# EAGLE design INS (EAGLE 9.6.2)
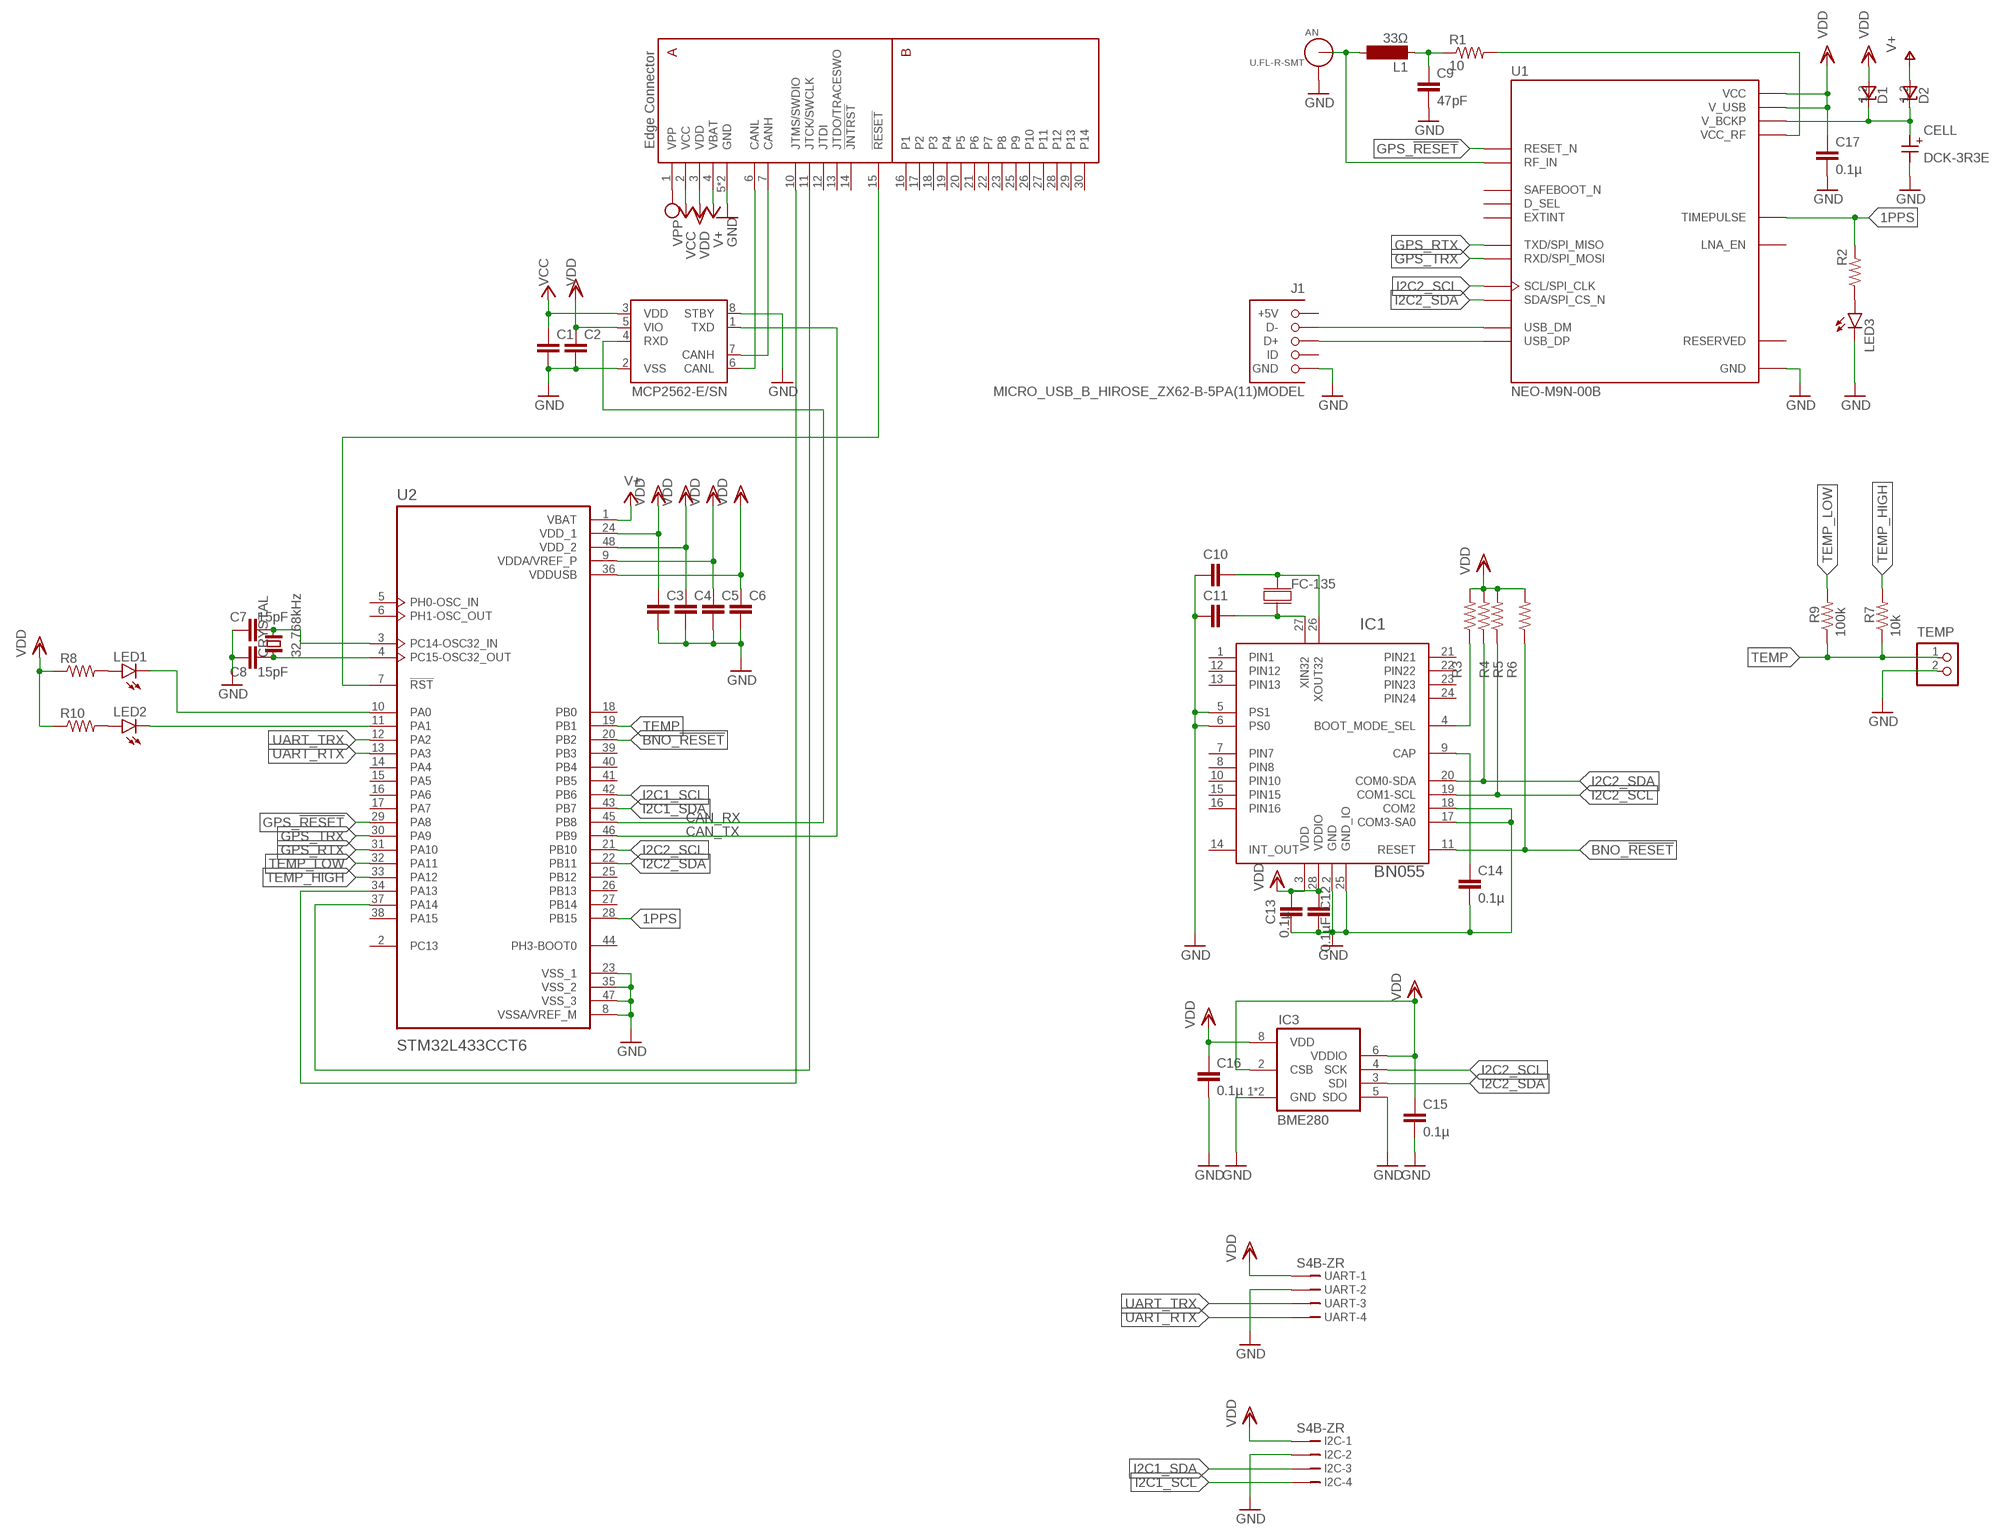
[diagram p0: schematic, sheet 1]

## Parts
AN  U.FL-R-SMT  [U.FL_SMT]
C1  C-EUC0603K  [C0603K]
C2  C-EUC0603K  [C0603K]
C3  C-EUC0603K  [C0603K]
C4  C-EUC0603K  [C0603K]
C5  C-EUC0603K  [C0603K]
C6  C-EUC0603K  [C0603K]
C7  15pF  C-EUC0603K  [C0603K]
C8  15pF  C-EUC0603K  [C0603K]
C9  47pF  C-EUC0603  [C0603]
C10  C-EUC0603  [C0603]
C11  C-EUC0603  [C0603]
C12  0.1µF  C-EUC0603  [C0603]
C13  0.1µ  C-EUC0603  [C0603]
C14  0.1µ  C-EUC0603  [C0603]
C15  0.1µ  C-EUC0603  [C0603]
C16  0.1µ  C-EUC0603  [C0603]
C17  0.1µ  C-EUC0603  [C0603]
CELL  DCK-3R3E  [DC,DCK]
CRYSTAL  32.768kHz  CRYTALFC-255  [FC-255]
D1  RB521S-30TE61  [SODFL1608X70N]
D2  RB521S-30TE61  [SODFL1608X70N]
FC-135  FC-135  [FC-135]
I2C  S4B-ZR  [S4B-ZR]
IC1  BN055  1658_BNO055  [LGA-28_3.80X5.20/0.5]
IC3  BME280  [BME280]
J1  MICRO_USB_B_HIROSE_ZX62-B-5PA(11)MODEL  [GHI-CONNECTORS_10118192-0001LF(MICRO-USB-B-AMPHENOL-FCI)]
L1  33Ω  SM-NE29  [SM-NE29]
LED1  LEDCHIP-LED0603  [CHIP-LED0603]
LED2  LEDCHIP-LED0603  [CHIP-LED0603]
LED3  LEDCHIP-LED0603  [CHIP-LED0603]
MCP2562  MCP2562-E/SN  [SOIC127P600X175-8N]
R1  10  R-US_R0603  [R0603]
R2  R-US_R0603  [R0603]
R3  R-US_R0603  [R0603]
R4  R-US_R0603  [R0603]
R5  R-US_R0603  [R0603]
R6  R-US_R0603  [R0603]
R7  10k  R-US_R0603  [R0603]
R8  R-US_R0603  [R0603]
R9  100k  R-US_R0603  [R0603]
R10  R-US_R0603  [R0603]
TEMP  S2B-PH-K-S  [S2B-PH-K-S]
U1  NEO-M9N-00B  [XCVR_NEO-M9N-00B]
U2  STM32L433CCT6  [QFP50P900X900X160-48N]
U$2  EDGE30  [EDGE30]
UART  S4B-ZR  [S4B-ZR]

## Nets
1PPS: LED3.A R2.1 R2.2 U1.3(TIMEPULSE) U2.28(PB15)
ANT: AN.SIG(ANT) L1.2 U1.11(RF_IN)
BNO_!RESET!: IC1.11(RESET) R6.1 U2.20(PB2)
CAN_RX: MCP2562.4(RXD) U2.45(PB8)
CAN_TX: MCP2562.1(TXD) U2.46(PB9)
CANH1: MCP2562.7(CANH) U$2.7(CANH)
CANL1: MCP2562.6(CANL) U$2.6(CANL)
GND: AN.GND1 AN.GND2 C1.2 C2.2 C3.2 C4.2 C5.2 C6.2 C7.1 C8.1 C9.2 C10.1 C11.1 C12.2 C13.2 C14.2 C15.2 C16.2 C17.2 CELL.- I2C.2 IC1.2(GND) IC1.5(PS1) IC1.6(PS0) IC1.17(COM3-SA0) IC1.18(COM2) IC1.25(GND_IO) IC3.1(GND) IC3.5(SDO) IC3.7(GND) J1.CGND1(GND) J1.CGND2(GND) J1.CGND3(GND) J1.CGND4(GND) J1.CGND5(GND) J1.CGND6(GND) J1.GND LED3.C MCP2562.2(VSS) MCP2562.8(STBY) TEMP.2 U1.10(GND) U1.12(GND) U1.13(GND) U1.24(GND) U2.8(VSSA/VREF_M) U2.23(VSS_1) U2.35(VSS_2) U2.47(VSS_3) U$2.5(GND) U$2.8(GND) UART.2
GPS_!RESET!: U1.8(RESET_N) U2.29(PA8)
GPS_RTX: U1.20(TXD/SPI_MISO) U2.31(PA10)
GPS_TRX: U1.21(RXD/SPI_MOSI) U2.30(PA9)
I2C1_SCL: I2C.4 U2.42(PB6)
I2C1_SDA: I2C.3 U2.43(PB7)
I2C2_SCL: IC1.19(COM1-SCL) IC3.4(SCK) R5.1 U1.19(SCL/SPI_CLK) U2.21(PB10)
I2C2_SDA: IC1.20(COM0-SDA) IC3.3(SDI) R4.1 U1.18(SDA/SPI_CS_N) U2.22(PB11)
N$1: R1.2 U1.9(VCC_RF)
N$4: U2.7(!RST) U$2.15(!RESET!)
N$5: IC1.4(BOOT_MODE_SEL) R3.1
N$6: LED1.C U2.10(PA0)
N$7: C9.1 L1.1 R1.1
N$8: LED2.C U2.11(PA1)
N$10: C14.1 IC1.9(CAP)
N$11: CELL.+ D1.1(K) D2.1(K) U1.22(V_BCKP)
N$12: LED2.A R10.2
N$13: C11.2 FC-135.P$2 IC1.27(XIN32)
N$14: C10.2 FC-135.P$1 IC1.26(XOUT32)
N$70: C8.2 CRYSTAL.1 U2.4(PC15-OSC32_OUT)
N$71: C7.2 CRYSTAL.2 U2.3(PC14-OSC32_IN)
N$74: LED1.A R8.2
SWCLK1: U2.37(PA14) U$2.11(JTCK/SWCLK)
SWDIO1: U2.34(PA13) U$2.10(JTMS/SWDIO)
TEMP: R7.1 R9.1 TEMP.1 U2.19(PB1)
TEMP_HIGH: R7.2 U2.33(PA12)
TEMP_LOW: R9.2 U2.32(PA11)
UART_RTX: U2.13(PA3) UART.4
UART_TRX: U2.12(PA2) UART.3
USB_D+: J1.D+ U1.6(USB_DP)
USB_D-: J1.D- U1.5(USB_DM)
VBAT: D2.2(A) U2.1(VBAT) U$2.4(VBAT) ; supply symbol labelled V+
VCC: C1.1 MCP2562.3(VDD) U$2.2(VCC)
VDD: C2.1 C3.1 C4.1 C5.1 C6.1 C12.1 C13.1 C15.1 C16.1 C17.1 D1.2(A) I2C.1 IC1.3(VDD) IC1.28(VDDIO) IC3.2(CSB) IC3.6(VDDIO) IC3.8(VDD) MCP2562.5(VIO) R3.2 R4.2 R5.2 R6.2 R8.1 R10.1 U1.7(V_USB) U1.23(VCC) U2.9(VDDA/VREF_P) U2.24(VDD_1) U2.36(VDDUSB) U2.48(VDD_2) U$2.3(VDD) UART.1
VPP: U$2.1(VPP)
Unconnected: IC1.1(PIN1) IC1.7(PIN7) IC1.8(PIN8) IC1.10(PIN10) IC1.12(PIN12) IC1.13(PIN13) IC1.14(INT_OUT) IC1.15(PIN15) IC1.16(PIN16) IC1.21(PIN21) IC1.22(PIN22) IC1.23(PIN23) IC1.24(PIN24) J1.ID J1.VBUS(+5V) U1.1(SAFEBOOT_N) U1.2(D_SEL) U1.4(EXTINT) U1.14(LNA_EN) U1.15(RESERVED) U1.16(RESERVED) U1.17(RESERVED) U2.2(PC13) U2.5(PH0-OSC_IN) U2.6(PH1-OSC_OUT) U2.14(PA4) U2.15(PA5) U2.16(PA6) U2.17(PA7) U2.18(PB0) U2.25(PB12) U2.26(PB13) U2.27(PB14) U2.38(PA15) U2.39(PB3) U2.40(PB4) U2.41(PB5) U2.44(PH3-BOOT0) U$2.12(JTDI) U$2.13(JTDO/TRACESWO) U$2.14(!JNTRST!) U$2.16(P1) U$2.17(P2) U$2.18(P3) U$2.19(P4) U$2.20(P5) U$2.21(P6) U$2.22(P7) U$2.23(P8) U$2.25(P9) U$2.26(P10) U$2.27(P11) U$2.28(P12) U$2.29(P13) U$2.30(P14)

## Library data of the parts
AN = connector:U.FL-R-SMT: U.FL-R-SMT Antenna Connector; DIGIKEY: H122041-ND; MANUFACTURER: Hirose; MPN: U.FL-R-SMT-1(01)
C1-C17 = rcl:C-EU: CAPACITOR, European symbol; SPICEPREFIX: C
CELL = capacitors:DCK-3R3E
CRYSTAL = crystal':CRYTAL: CRYSTAL
D1 D2 = RB521S-30TE61:RB521S-30TE61: ROHM - RB521S-30TE61 - DIODE, SCHOTTKY, SMD Source: Datasheet <https://componentsearchengine.com/Datasheets/2/RB521S-30TE61.pdf>; DESCRIPTION: ROHM - RB521S-30TE61 - DIODE, SCHOTTKY, SMD; HEIGHT: 0.7mm; MANUFACTURER_NAME: ROHM Semiconductor; MANUFACTURER_PART_NUMBER: RB521S-30TE61; MOUSER_PART_NUMBER: 755-RB521S-30TE61; MOUSER_PRICE-STOCK: https://www.mouser.com/Search/Refine.aspx?Keyword=755-RB521S-30TE61; RS_PART_NUMBER: 0178677; RS_PRICE-STOCK: http://uk.rs-online.com/web/p/products/0178677
FC-135 = tere:FC-135
I2C UART = con-jst:?4B-ZR: ZH CONNECTOR 1.5 mm, 4 pin 1 row Source: http://www.jst.com .. eZH.pdf; MF: FARNELL; MPN: S4B-ZR(LF)(SN); OC_FARNELL: 9491830; OC_NEWARK: 38K8076
IC1 = BNO055:1658_BNO055: BN055 Intelligent 9-axis absolute orientation sensor; PART_NUMBER: BNO055
IC3 = bosch-bme280:BME280: DIGITAL HUMIDITY, PRESSURE AND TEMPERATURE SENSOR * Digital interface I²C (up to 3.4 MHz) and SPI (3 and 4 wire, up to 10 MHz)* Supply voltage VDD main supply voltage range: 1.71 V to 3.6 V*VDDIO interface voltage range: 1.2 V to 3.6 V Operating range -40…+85 °C, 0…100 % rel. humidity, 300…1100 hPa The library has been designed by Richard Magdycz <https://www.facebook.com/groups/eaglecadsoftUK>
J1 = connector:MICRO_USB_B_HIROSE_ZX62-B-5PA(11): Connector Receptacle USB - micro B 2.0 5 Position Surface Mount, Right Angle, Horizontal Bottom Mount
L1 = inductor-neosid:SM-NE29: INDUCTOR SMD chip inductor; OC_FARNELL: unknown; OC_NEWARK: unknown
LED1-LED3 = led:LED: LED OSRAM: - CHIPLED LG R971, LG N971, LY N971, LG Q971, LY Q971, LO R971, LY R971 LH N974, LH R974 LS Q976, LO Q976, LY Q976 LO Q996 - Hyper CHIPLED LW Q18S LB Q993, LB Q99A, LB R99A - SideLED LS A670, LO A670, LY A670, LG A670, LP A670 LB A673, LV A673, LT A673, LW A673 LH A674 LY A675 LS A676, LA A676, LO A676, LY A676, LW A676 LS A679, LY A679, LG A679 - Hyper Micro SIDELED® LS Y876, LA Y876, LO Y876, LY Y876 LT Y87S - SmartLED LW L88C, LW L88S LB L89C, LB L89S, LG L890 LS L89K, LO L89K, LY L89K LS L896, LA L896, LO L896, LY L896 - TOPLED LS T670, LO T670, LY T670, LG T670, LP T670 LSG T670, LSP T670, LSY T670, LOP T670, LYG T670 LG T671, LOG T671, LSG T671 LB T673, LV T673, LT T673, LW T673 LH T674 LS T676, LA T676, LO T676, LY T676, LB T676, LH T676, LSB T676, LW T676 LB T67C, LV T67C, LT T67C, LS T67K, LO T67K, LY T67K, LW E67C LS E67B, LA E67B, LO E67B, LY E67B, LB E67C, LV E67C, LT E67C LW T67C LS T679, LY T679, LG T679 LS T770, LO T770, LY T770, LG T770, LP T770 LB T773, LV T773, LT T773, LW T773 LH T774 LS E675, LA E675, LY E675, LS T675 LS T776, LA T776, LO T776, LY T776, LB T776 LHGB T686 LT T68C, LB T68C - Hyper Mini TOPLED® LB M676 - Mini TOPLED Santana® LG M470 LS M47K, LO M47K, LY M47K Source: http://www.osram.convergy.de LUXEON: - LUMILED® LXK2-PW12-R00, LXK2-PW12-S00, LXK2-PW14-U00, LXK2-PW14-V00 LXK2-PM12-R00, LXK2-PM12-S00, LXK2-PM14-U00 LXK2-PE12-Q00, LXK2-PE12-R00, LXK2-PE12-S00, LXK2-PE14-T00, LXK2-PE14-U00 LXK2-PB12-K00, LXK2-PB12-L00, LXK2-PB12-M00, LXK2-PB14-N00, LXK2-PB14-P00, LXK2-PB14-Q00 LXK2-PR12-L00, LXK2-PR12-M00, LXK2-PR14-Q00, LXK2-PR14-R00 LXK2-PD12-Q00, LXK2-PD12-R00, LXK2-PD12-S00 LXK2-PH12-R00, LXK2-PH12-S00 LXK2-PL12-P00, LXK2-PL12-Q00, LXK2-PL12-R00 Source: www.luxeon.com KINGBRIGHT: KA-3528ASYC Source: www.kingbright.com
MCP2562 = mcp2562-E_SN:MCP2562-E/SN: MCP2562 Series 5 V Surface Mount High-Speed CAN Transceiver - SOIC-8; AVAILABILITY: Unavailable; DESCRIPTION: Microchip MCP2562-E/SN, CAN Transceiver 1MBps 1-channel IEC 61000-4-2, 8-Pin SOIC; MF: Microchip; MP: MCP2562-E/SN; PACKAGE: SO-8 Microchip; PRICE: None
R1-R10 = rcl:R-US_: RESISTOR, American symbol; SPICEPREFIX: R
TEMP = jst-ph:S2B-PH-*: Wire-to-Board 2.0mm pitch side mount connector Source: http://www.jst-mfg.com/product/pdf/jpn/PH.pdf http://www.jst-mfg.com/product/detail.php?series=199
U1 = NEO-M9N-00B:NEO-M9N-00B: Check availability <https://pricing.snapeda.com/parts/NEO-M9N-00B/u-blox/view-part?ref=eda>; AVAILABILITY: In Stock; DESCRIPTION: series RF Receiver BeiDou, Galileo, GLONASS, GNSS, GPS - -167dBm - - Module; MF: u-blox; MP: NEO-M9N-00B; PACKAGE: SMD-24 u-blox; PRICE: None; PURCHASE-URL: https://pricing.snapeda.com/search/part/NEO-M9N-00B/?ref=eda
U2 = STM32L433CCT6:STM32L433CCT6: None Check availability <https://pricing.snapeda.com/parts/STM32L433CCT6/STMicroelectronics/view-part?ref=eda>; AVAILABILITY: In Stock; DESCRIPTION: ARM® Cortex®-M4 STM32L4 Microcontroller IC 32-Bit Single-Core 80MHz 256KB (256K x 8) FLASH 48-LQFP (7x7); MF: STMicroelectronics; MP: STM32L433CCT6; PACKAGE: LQFP-48 STMicroelectronics; PRICE: None; PURCHASE-URL: https://pricing.snapeda.com/search/part/STM32L433CCT6/?ref=eda
U$2 = bus:EDGE30

## Net classes
0 default: width 0.254 mm, clearance 0.025 mm

## Board
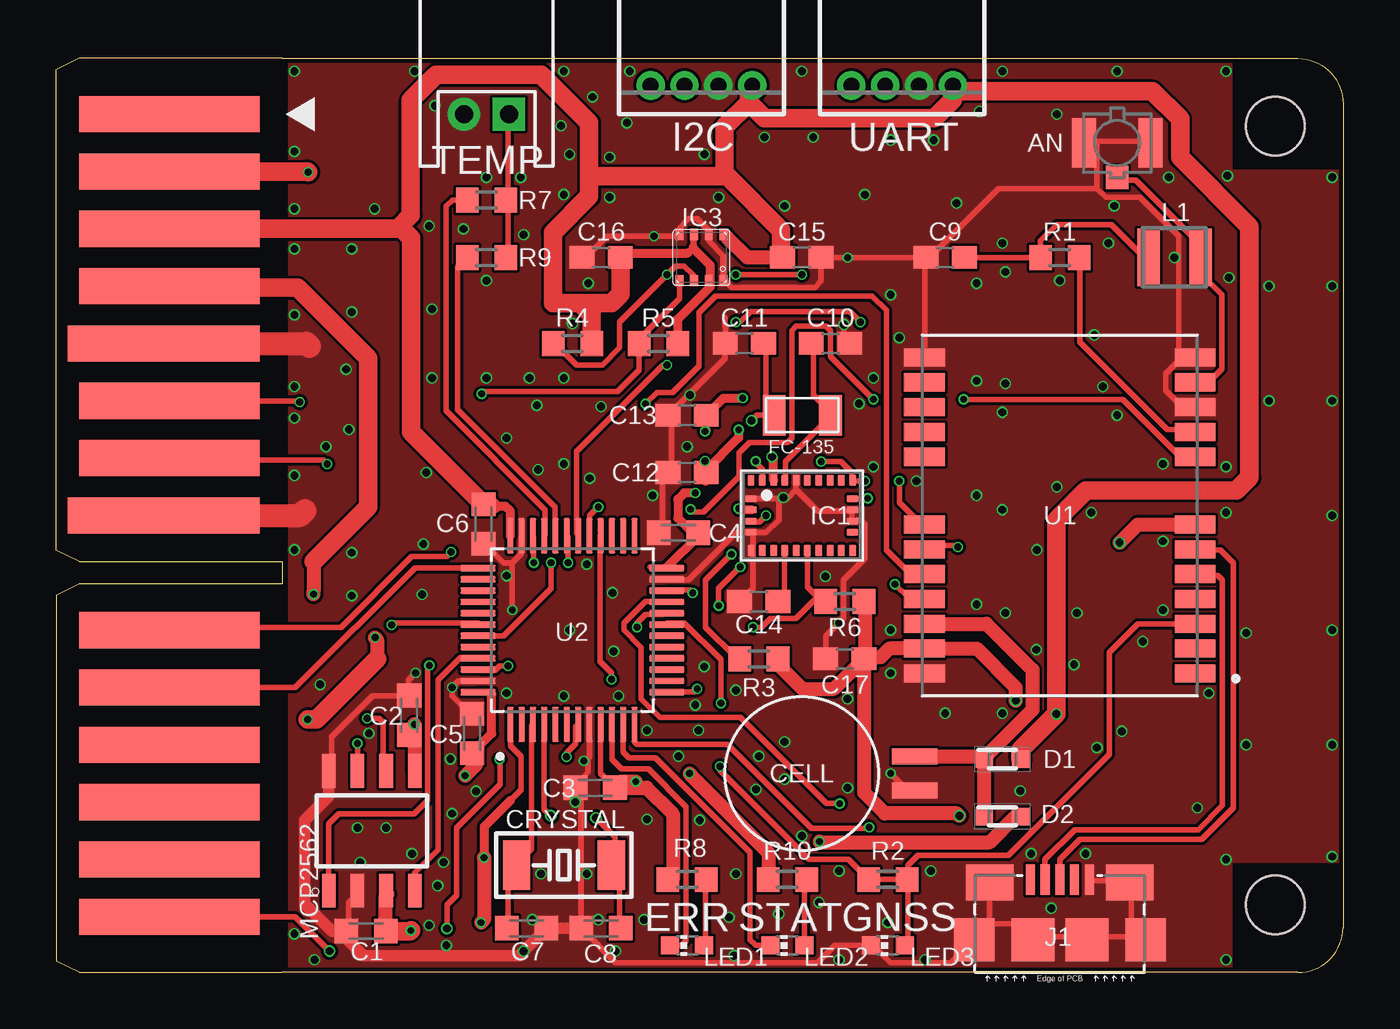
[diagram p1: board, top side]
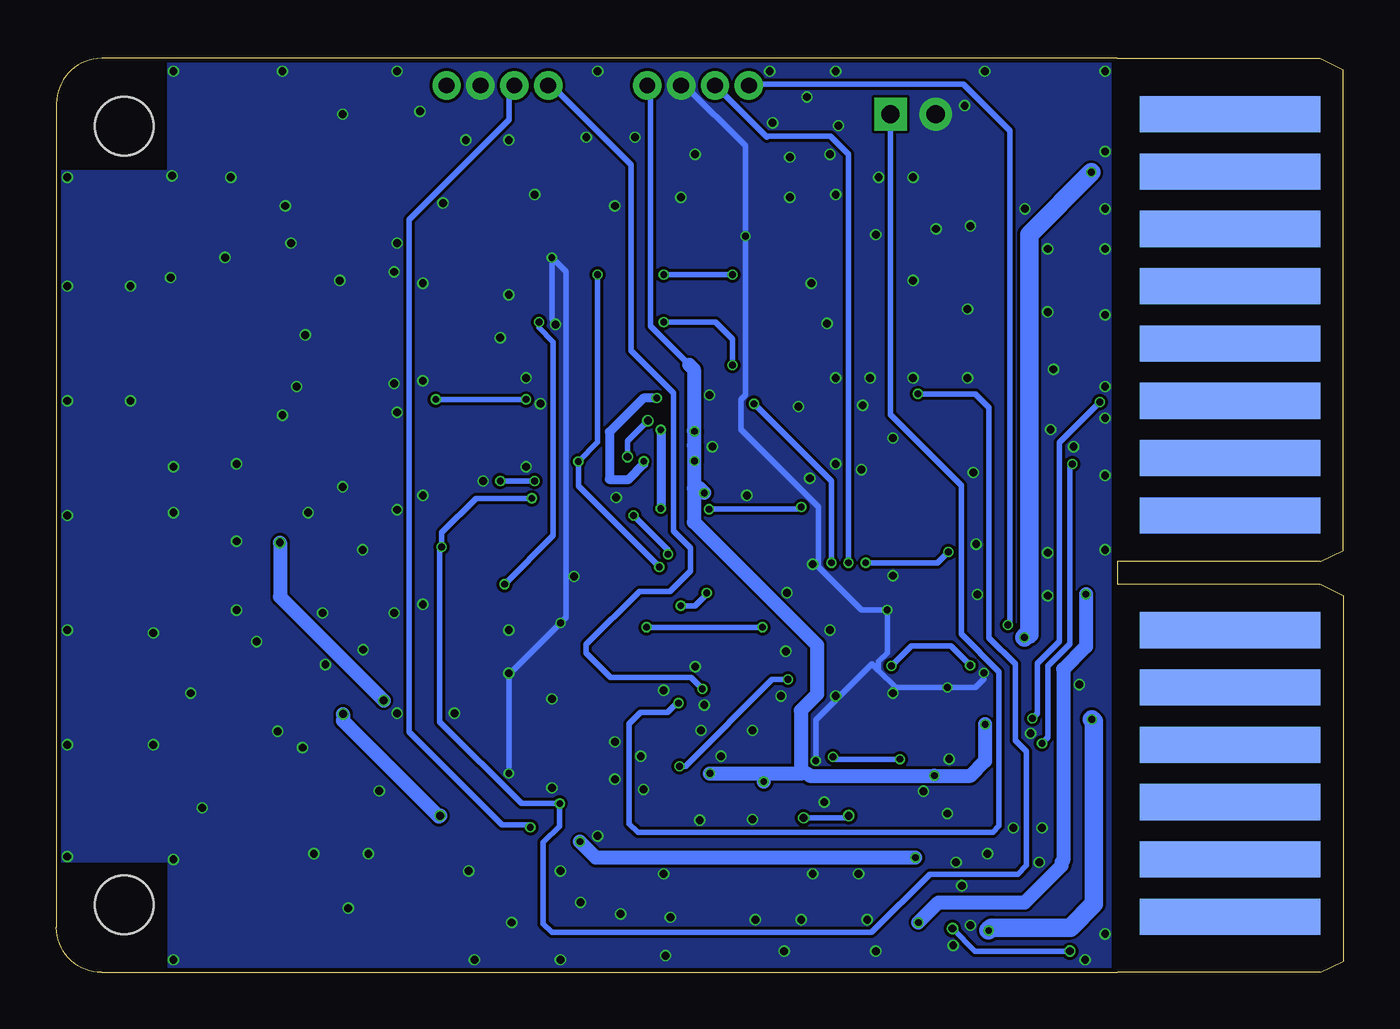
[diagram p2: board, bottom side, seen from below]

Size 57 x 40.5 mm. Coordinates in mm from the lower left corner, seen from the top.
Outline: 10,40.5 55,40.5 arc-90 57,38.5 57,2 arc-90 55,0 10,0
Copper layers (1*16): Top 0.035mm / dielectric 1.6mm / Bottom 0.035mm
Design rules "jlcpcb-2layers_": minimum track width 5mil, minimum drill 0.3mm, track to track 5mil, track to pad 5mil, pad to pad 5mil, via to via 5mil, smd to smd 5mil, copper to edge 0.2mm, drill to drill 6mil, minimum pad ring 10mil, minimum via ring 3mil, stop-mask expansion 4mil, vias tented up to drill 100mil, thermal gap 10mil
Holes 2.6 mm at 54,3 54,37.5

### Footprints (pad centres in the part's own frame; a part is rotated, then mirrored left to right if it is on the bottom)
U.FL_SMT = smd 1.05 x 2.2: GND1 -1.475,0; GND2 1.475,0 | smd 1 x 1.05: SIG 0,-1.525
C0603K = smd 1.05 x 1.08: 1 -0.875,0; 2 0.875,0
C0603 = smd 1.1 x 1: 1 -0.85,0; 2 0.85,0
DC,DCK = smd 0.7 x 2: + 0.75,-5; - -0.75,-5
FC-255 = smd 1.2 x 2.2: 1 -2.1,0; 2 2.1,0
SODFL1608X70N = smd 0.769 x 0.776: 1 -0.8,0; 2 0.8,0
FC-135 = smd 1 x 1.8: P$1 0,0; P$2 2.5,0
S4B-ZR = drill 0.7 pad 1.1: 1 -2.25,0; 2 -0.75,0; 3 0.75,0; 4 2.25,0
LGA-28_3.80X5.20/0.5 = smd 0.3 x 0.5: 1 -2.25,1.56; 6 -2.25,-1.56; 7 -1.75,-1.56; 8 -1.25,-1.56; 9 -0.75,-1.56; 10 -0.25,-1.56; 11 0.25,-1.56; 12 0.75,-1.56; 13 1.25,-1.56; 14 1.75,-1.56; 15 2.25,-1.56; 20 2.25,1.56; 21 1.75,1.56; 22 1.25,1.56; 23 0.75,1.56; 24 0.25,1.56; 25 -0.25,1.56; 26 -0.75,1.56; 27 -1.25,1.56; 28 -1.75,1.56 | smd 0.5 x 0.3: 2 -2.25,0.75; 3 -2.25,0.25; 4 -2.25,-0.25; 5 -2.25,-0.75; 16 2.25,-0.75; 17 2.25,-0.25; 18 2.25,0.25; 19 2.25,0.75
BME280 = smd 0.35 x 0.5: 1 0.975,-1.025; 2 0.325,-1.025; 3 -0.325,-1.025; 4 -0.975,-1.025; 5 -0.975,1.025; 6 -0.325,1.025; 7 0.325,1.025; 8 0.975,1.025
GHI-CONNECTORS_10118192-0001LF(MICRO-USB-B-AMPHENOL-FCI) = smd 1.8 x 1.9: CGND1 -3.8,0; CGND4 3.8,0 | smd 1.9 x 1.9: CGND2 -1.2,0; CGND3 1.2,0 | smd 2.1 x 1.6: CGND5 3.1,2.55; CGND6 -3.1,2.55 | smd 0.4 x 1.35: D+ 0,2.675; D- -0.65,2.675; GND 1.3,2.675; ID 0.65,2.675; VBUS -1.3,2.675
SM-NE29 = smd 1 x 2.54: 1 -1.15,0; 2 1.15,0
CHIP-LED0603 = smd 0.8 x 0.8: A 0,-0.75; C 0,0.75
SOIC127P600X175-8N = smd 1.5 x 0.6: 1 -2.65,1.905; 2 -2.65,0.635; 3 -2.65,-0.635; 4 -2.65,-1.905; 5 2.65,-1.905; 6 2.65,-0.635; 7 2.65,0.635; 8 2.65,1.905
R0603 = smd 1 x 1.1: 1 -0.85,0; 2 0.85,0
S2B-PH-K-S = drill 0.8 square: 1 1,0 | drill 0.8: 2 -1,0
XCVR_NEO-M9N-00B = smd 1.8 x 0.8: 1 -6,7; 2 -6,5.9; 3 -6,4.8; 4 -6,3.7; 5 -6,2.6; 6 -6,1.5; 7 -6,0.4; 8 -6,-2.6; 9 -6,-3.7; 10 -6,-4.8; 11 -6,-5.9; 12 -6,-7; 13 6,-7; 14 6,-5.9; 15 6,-4.8; 16 6,-3.7; 17 6,-2.6; 18 6,0.4; 19 6,1.5; 20 6,2.6; 21 6,3.7; 22 6,4.8; 23 6,5.9; 24 6,7
QFP50P900X900X160-48N = smd 1.56 x 0.28: 1 -4.18,2.75; 2 -4.18,2.25; 3 -4.18,1.75; 4 -4.18,1.25; 5 -4.18,0.75; 6 -4.18,0.25; 7 -4.18,-0.25; 8 -4.18,-0.75; 9 -4.18,-1.25; 10 -4.18,-1.75; 11 -4.18,-2.25; 12 -4.18,-2.75; 25 4.18,-2.75; 26 4.18,-2.25; 27 4.18,-1.75; 28 4.18,-1.25; 29 4.18,-0.75; 30 4.18,-0.25; 31 4.18,0.25; 32 4.18,0.75; 33 4.18,1.25; 34 4.18,1.75; 35 4.18,2.25; 36 4.18,2.75 | smd 0.28 x 1.56: 13 -2.75,-4.18; 14 -2.25,-4.18; 15 -1.75,-4.18; 16 -1.25,-4.18; 17 -0.75,-4.18; 18 -0.25,-4.18; 19 0.25,-4.18; 20 0.75,-4.18; 21 1.25,-4.18; 22 1.75,-4.18; 23 2.25,-4.18; 24 2.75,-4.18; 37 2.75,4.18; 38 2.25,4.18; 39 1.75,4.18; 40 1.25,4.18; 41 0.75,4.18; 42 0.25,4.18; 43 -0.25,4.18; 44 -0.75,4.18; 45 -1.25,4.18; 46 -1.75,4.18; 47 -2.25,4.18; 48 -2.75,4.18
EDGE30 = smd 1.6 x 8: 1 -17.78,-5; 2 -15.24,-5; 3 -12.7,-5; 4 -10.16,-5; 6 -5.08,-5; 7 -2.54,-5; 10 5.08,-5; 11 7.62,-5; 12 10.16,-5; 13 12.7,-5; 14 15.24,-5; 15 17.78,-5 | smd 1.6 x 8.5: 5 -7.62,-5.25; 8 0,-5.25 | smd 1.6 x 8 bottom: 16 -17.78,-5; 17 -15.24,-5; 18 -12.7,-5; 19 -10.16,-5; 20 -7.62,-5; 21 -5.08,-5; 22 -2.54,-5; 23 0,-5; 25 5.08,-5; 26 7.62,-5; 27 10.16,-5; 28 12.7,-5; 29 15.24,-5; 30 17.78,-5

### Placement (x,y rotation side)
AN  46.99,36.76 0 top
C1  13.72,1.84 180 top
C2  15.63,11.41 90 top
C3  23.88,8.19 180 top
C4  27.56,19.49 180 top
C5  18.41,10.6 90 top
C6  18.92,19.87 270 top
C7  20.83,1.96 180 top
C8  24.13,1.96 0 top
C9  39.37,31.68 180 top
C10  34.29,27.87 180 top
C11  30.48,27.87 0 top
C12  27.94,22.16 180 top
C13  27.94,24.7 180 top
C14  31.11,16.44 180 top
C15  33.02,31.68 0 top
C16  24.13,31.68 180 top
C17  34.92,13.9 180 top
CELL  33.02,8.82 90 top
CRYSTAL  22.48,4.76 180 top
D1  41.91,9.46 0 top
D2  41.91,6.91 0 top
FC-135  34.29,24.7 180 top
I2C  28.57,39.3 180 top
IC1  33.02,20.25 0 top
IC3  28.57,31.68 0 top
J1  44.45,1.45 0 top
L1  49.53,31.68 0 top
LED1  27.94,1.2 90 top
LED2  32.38,1.2 90 top
LED3  36.83,1.2 90 top
MCP2562  13.97,6.28 90 top
R1  44.45,31.68 0 top
R2  36.83,4.12 0 top
R3  31.11,13.9 0 top
R4  22.86,27.87 0 top
R5  26.67,27.87 0 top
R6  34.92,16.44 0 top
R7  19.05,34.22 180 top
R8  27.94,4.12 0 top
R9  19.05,31.68 180 top
R10  32.38,4.12 0 top
TEMP  19.05,38.03 0 top
U1  44.45,20.25 180 top
U2  22.86,15.17 90 top
U$2  10,20.25 270 top
UART  37.47,39.3 180 top

### Tracks (layer width: path | path; a pad name or v marks a point on that pad's centre or on a via)
1PPS  (via drill 0.3)
  Top 0.254: 37.72,4.12 37.72,4.76 38.16,5.2 42.16,5.2 46.64,9.67 46.64,14.18 47.91,15.45 U1.3 | 37.72,4.12 37.72,1.2 LED3.A | U2.28 24.09,19.33 24.09,13.78 24.59,13.28 v24.59,12.98 | v29.4,9.14 29.4,8.95 33.34,5.01 35.09,5.01 R2.1 R2.2 37.72,4.12
  Bottom 0.254: v29.4,9.14 29.14,9.14 25.29,12.98 v24.59,12.98
ANT
  Top 0.254: AN.SIG 47.05,35.11 47.82,35.11 50.67,32.25 L1.2 50.68,30.98 51.63,30.03 51.63,26.73 51.05,26.16 50.48,26.16 U1.11
BNO_!RESET!  (via drill 0.3)
  Top 0.254: IC1.11 33.27,17.07 33.72,16.63 | 33.72,16.63 33.91,16.44 R6.1 33.72,16.63 | v25.72,15.3 25.72,15.49 26.1,15.87 26.86,15.87 U2.20 | v30.86,15.3 31.24,15.3 31.62,15.68 32.77,15.68 33.72,16.63
  Bottom 0.254: v30.86,15.3 v25.72,15.3
CAN_RX
  Top 0.254: MCP2562.4 15.88,4.42 16.9,5.44 16.9,12.96 17.91,13.96 18.67,13.96 U2.45
CAN_TX  (via drill 0.3)
  Top 0.254: v20,13.58 19.62,13.58 19.43,13.39 18.86,13.39 U2.46 | v16.52,13.6 16.45,13.6 16.45,7.64 15.84,7.03 12.51,7.03 12.06,6.59 MCP2562.1
  Bottom 0.254: v16.52,13.6 17.38,14.46 19.12,14.46 v20,13.58
CANH1  (via drill 0.3)
  Top 0.254: v13.34,10.15 MCP2562.7 | v12,22.53 11.83,22.7 5.17,22.7 5.14,22.73 U$2.7
  Bottom 0.254: v13.34,10.15 13.07,10.42 13.07,13.57 12.1,14.55 12.1,22.43 v12,22.53
CANL1  (via drill 0.3)
  Top 0.254: v13.77,11.26 14.3,11.26 14.48,11.08 14.48,9.01 MCP2562.6 | U$2.6 10.72,25.33 v10.77,25.28
  Bottom 0.254: v13.77,11.26 13.55,11.48 13.55,13.69 12.57,14.67 12.57,23.48 v10.77,25.28
GND  (via drill 0.3, 0.35)
  Top 0.254: J1.CGND1 40.58,1.39 39.62,0.44 36.96,0.44 36.2,1.2 LED3.C 34.48,1.2 33.72,0.44 24.78,0.44 C8.1 23.24,7.87 23.05,8.06 C3.2 23.55,8.89 23.55,9.38 | 41.34,2.15 41.34,3.87 J1.CGND6 | 41.34,2.15 40.77,1.58 J1.CGND1 | J1.GND 45.91,4.06 47.43,4.06 J1.CGND5 47.62,3.87 47.62,1.58 | 47.62,1.58 45.72,1.58 J1.CGND3 45.53,1.58 43.43,1.58 J1.CGND2 43.24,1.58 42.67,2.15 41.34,2.15 | 47.62,1.58 48.2,1.58 J1.CGND4 47.62,1.58 | 41.34,2.15 J1.CGND1 | C1.2 12.95,1.96 12.95,3.11 13.34,3.49 MCP2562.2 | 23.55,9.38 23.55,9.48 23.62,9.55 23.62,10.91 U2.8 | C4.2 26.86,19.49 26.86,21.96 27.05,22.16 C12.2 27.24,22.16 27.24,24.63 C13.2 27.24,24.82 29.63,27.21 C11.1 | 35.05,28.25 35.05,27.87 C10.1 34.89,28.12 v34.89,28.71 | C11.1 29.91,27.87 | 30.86,19.49 30.86,18.73 IC1.6 30.86,18.54 30.86,17.01 30.29,16.44 C14.2 | U2.23 27.05,17.39 28,17.39 30.1,19.49 30.67,19.49 IC1.5 30.86,19.49 | 35.24,20.44 35.24,20.06 IC1.17 35.43,20.06 35.62,20.06 35.81,19.87 35.81,18.34 34.86,17.39 34.86,15.68 v34.67,15.49 34.1,14.92 34.1,13.96 C17.2 | 32,21.01 32.38,21.01 32.77,21.39 | 32,21.01 30.86,21.01 IC1.2 | 32.77,21.39 32.77,21.77 IC1.25 | 35.24,20.44 33.72,20.44 32.77,21.39 | 35.24,20.44 IC1.18 | 38.29,13.2 U1.24 | v36.96,8.82 37.53,8.25 37.91,8.25 CELL.- | 30.86,19.49 31.43,19.49 32,20.06 32,21.01 | 49.72,27.11 49.15,26.54 49.15,25.77 49.72,25.2 50.29,25.2 U1.10 | 49.72,27.11 50.29,27.11 U1.12 49.72,27.11 | 46.1,36.82 48.39,36.82 AN.GND2 | 46.1,36.82 45.53,36.82 AN.GND1 | 49.72,27.11 49.72,32.63 48.01,34.35 46.48,34.35 46.1,34.73 | 46.1,36.82 46.1,34.73 | C16.2 23.43,31.68 24.38,32.63 v26.48,32.63 27.43,32.63 IC3.5 27.62,32.82 27.62,33.01 28,33.39 28.38,33.39 28.96,32.82 IC3.7 28.9,32.4 29.53,31.77 29.53,30.73 IC3.1 29.72,30.54 29.9,30.36 33.59,30.36 33.87,30.63 C15.2 v35.05,31.68 38.48,31.68
  Top 0.254: 38.48,31.68 38.48,27.3 U1.13 | 38.48,31.68 C9.2 38.67,31.68 41.72,34.73 46.1,34.73 | 20.19,18.16 19.81,18.16 19.05,18.92 C6.2 | 20.19,18.16 20.57,18.54 20.57,19.3 U2.35 | U2.47 | U2.47 17.82,12.92 v17.53,12.63 17.53,12.25 18.29,11.49 C5.2 | MCP2562.8 12.19,9.01 12.19,10.44 14,12.25 15.6,12.25 C2.2 15.6,12.96 v15.91,13.27 | v20.19,16.06 20.19,18.16 | v23.36,9.38 23.55,9.38 | 29.62,29.02 29.62,28.62 29.63,28.61 C11.1
  Top 0.508: C8.1 C7.1 20.49,0.75 13.6,0.75 12.84,1.51 C1.2 12.21,1.84 11,3.05 11,6.75 12.06,7.81 MCP2562.8
  Top 1.016: U$2.5 11.08,27.87 11.2,27.75 | U$2.8 10.8,20.25 11,20.45
  Bottom 0.254: v36.96,8.82 36.96,13.2 v34.67,15.49 34.42,15.74 34.42,31.05 v35.05,31.68 35.05,28.95 34.89,28.79 v34.89,28.71 | I2C.2 29.15,39.3 26.48,36.63 v26.48,32.63 26.48,25.58 26.67,25.39 26.67,24.06 23.24,20.63 23.24,17.96 21.34,16.06 v20.19,16.06 20.19,14.15 20.57,13.77 20.57,13.39 | v15.91,13.27 15.91,13.02 16.29,12.63 v17.53,12.63 19.81,12.63 20.57,13.39 | 20.57,13.39 20.86,13.68 23.36,11.18 v23.36,9.38
  other vias: 47.2,10.69 21.28,25.13 16.2,16.75 18.59,8.03 43.41,14.3 28.5,6.75 42.7,8.05 28.7,13.55 24.68,14.23 28.3,11.85 29.8,2.45 30.02,0.75 23.56,30.54 34.07,17.55 32.2,21.05 24.9,12.25 56.52,35.24 51.88,35.3 51.82,39.94 46.99,39.94 41.91,39.94 33.02,39.94 25.4,39.94 22.48,39.94 15.88,39.94 10.54,39.94 10.54,36.38 10.54,33.84 14.1,33.84 16.76,38.41 16.51,33.08 19.05,35.24 22.35,37.52 20.57,35.24 22.73,36.25 20.7,32.7 18.03,32.95 10.54,32.06 13.08,32.06 13.08,29.27 16.64,29.39 16.64,26.35 10.54,29.14 12.83,26.73 10.54,25.96 12.95,24.06 10.54,24.57 11.94,23.3 10.54,22.03 10.54,18.73 13.08,18.6 13.08,16.69 11.68,12.76 13.34,6.41 13.46,4.88 14.61,6.41 15.75,5.26 10.54,1.71 11.43,0.57 17.27,1.2 16.51,2.09 16.89,3.85 17.14,4.88 17.53,7.04 17.45,9.46 13.84,10.6 16.26,18.98 16.38,22.16 19.05,30.66 19.05,26.35 19.94,23.68 21.34,22.28 22.48,22.54 24.13,25.08 22.48,26.35 20.95,26.35 22.86,28.76 22.48,34.47 23.75,38.79 25.27,37.65 24.51,36.12 19.94,17.58 23.5,18.09 22.73,15.17 19.94,12.38 22.48,12.25 20.7,0.95 24.77,0.95 21.08,2.34 24,2.34 23.5,4.38 21.46,4.38 22.99,7.55 26.16,6.79 26.04,2.34 26.16,10.72 24.64,16.82 26.42,21.14 23.62,21.9 28.07,25.58 27.94,23.3 24.51,34.35 29.34,34.35 28.7,36.25 31.37,37.01 33.53,37.01 36.96,36.89 32.26,33.97 36.96,30.03 39.88,34.09 40.77,30.54 40.77,26.22 36.2,26.35 35.56,25.2 36.2,22.41 37.34,28.12 38.1,21.77 40.77,21.14 40.77,16.31 42.04,15.93 43.43,18.73 41.91,20.5 41.91,24.82 44.32,21.52 39.37,11.49 36.96,13.27 36.96,15.17 35.05,12.12 30.1,12.5 32.26,10.22 35.05,8.19 32.26,8.57 31.11,9.58 28.45,10.72 27.56,9.58 32,2.6 34.67,4.5 33.78,3.11 30.1,4.38 34.67,0.57 36.83,2.22 38.48,0.57 38.73,4.5 43.18,5.26 51.82,0.57 51.82,5.01 45.59,5.26 44.07,2.85 50.55,7.3 51.05,12.38 48.13,14.66 46.1,9.96 45.09,13.65 49.02,19.11 49.02,16.06 45.21,15.93 45.85,20.38 56.52,5.14 56.52,10.09 56.52,15.17 52.7,10.09 52.7,15.04 51.82,20.38 56.52,20.25 56.52,25.33 56.52,30.41 53.72,30.41 53.72,25.33 51.82,22.41 49.02,22.54 46.99,24.7 46.35,25.96 51.94,30.79 49.53,31.68 42.04,26.09 42.04,31.05 44.45,30.66 46.61,32.31 45.97,28.25 38.86,36.89 44.32,38.03 41.91,32.31 35.81,34.47 49.28,35.24 46.86,33.97 40.89,38.16 33.02,6.05 30.99,8.11 41.91,11.49
  pour Top (no thermals): 25.53,1.33 19.43,2.09 19.43,1.33
  pour Bottom: 13.08,1.84 13.34,2.09 13.34,2.22 13.34,2.6 13.08,2.85 12.7,2.85 11.94,2.85
  pour Bottom (no thermals): 10.3,41.05 10.3,-0.55 52.03,-0.55 52.03,4.93 57.4,4.93 57.4,35.5 52.05,35.5 52.05,41.05
  pour Top (no thermals): 10.3,41.05 10.3,-0.75 52.05,-0.75 52.05,4.9 57.4,4.9 57.4,35.52 52.05,35.52 52.05,41.15 10.4,41.15
GPS_!RESET!  (via drill 0.3)
  Top 0.254: v24,20.63 23.62,20.25 23.62,19.49 U2.29 | v28.08,20.53 28.21,20.4 28.67,20.4 30.23,21.97 30.23,23.02 30.71,23.49 32.38,23.49 32.58,23.68 32.58,28.44 32.77,28.63 34.1,28.63 34.29,28.44 34.29,27.3 v36.2,25.39 | v40.2,25.39 47.24,25.39 49.72,22.92 50.29,22.92 U1.8
  Bottom 0.254: v28.08,20.53 24.1,20.53 v24,20.63 | v40.2,25.39 v36.2,25.39
GPS_RTX  (via drill 0.3)
  Top 0.254: v22.67,18.16 22.67,19.3 U2.31 | v26.1,25.2 26.6,25.7 27.29,25.7 28.46,26.88 28.46,29.24 29.2,29.98 36.13,29.98 36.77,29.34 36.77,18.73 37.72,17.77 38.29,17.77 U1.20
  Bottom 0.254: v22.67,18.16 22.67,21.77 v26.1,25.2
GPS_TRX  (via drill 0.3)
  Top 0.254: v27.05,26.92 26.88,26.92 23.05,23.09 23.05,19.49 U2.30 | v30.1,28.82 30.29,28.82 30.76,29.29 35.15,29.29 v35.62,28.82 | v37.15,17.2 37.72,16.63 38.29,16.63 U1.21
  Bottom 0.254: v30.1,28.82 27.8,28.82 27.05,28.07 v27.05,26.92 | v35.62,28.82 35.62,28.57 34.99,27.93 34.99,19.36 v37.15,17.2
I2C1_SCL  (via drill 0.3)
  Top 0.254: v14.85,15.4 14.94,15.49 18.67,15.49 U2.42
  Bottom 0.254: v14.85,15.4 14.76,15.5 14.76,37.3 16.83,39.36 26.23,39.36 26.29,39.3 I2C.4
I2C1_SDA  (via drill 0.3)
  Top 0.254: v21.91,18.16 21.91,17.01 19.81,14.92 18.86,14.92 U2.43
  Bottom 0.254: I2C.3 25.53,37.01 25.49,37.05 22.7,37.05 21.91,36.26 v21.91,18.16
I2C2_SCL  (via drill 0.3)
  Top 0.254: IC3.4 27.6,29.85 25.62,27.87 R5.1 25.82,26.69 24.86,25.74 18.93,25.74 v18.83,25.64 | v35.94,21.01 35.43,21.01 IC1.19 | v39.94,18.85 39.88,18.92 38.48,18.92 U1.19 | v34.7,7.49 34.12,7.49 30.31,11.3 26.73,11.3 25.91,12.12 25.91,14.41 25.15,15.17 25.15,15.49 26.1,16.44 26.86,16.44 U2.21
  Bottom 0.254: v35.94,21.01 38.42,21.01 39.94,19.49 v39.94,18.85 40.01,18.78 40.01,11.12 36.39,7.49 v34.7,7.49 34.7,6.49 35.43,5.76 35.43,2.15 35.05,1.77 20.89,1.77 18.3,4.36 14.42,4.36 14.04,4.74 14.04,9.79 14.53,10.28 14.53,13.68 15.68,14.84 15.68,25.03 16.29,25.64 v18.83,25.64
I2C2_SDA  (via drill 0.3)
  Top 0.254: IC3.3 28.19,30.73 28.19,30.92 27.81,31.3 27.43,31.3 v27.05,30.92 24.96,28.82 24.96,27.68 24.19,26.92 23.05,26.92 22.1,27.87 R4.1 | v35.81,21.77 35.24,21.77 IC1.20 35.24,21.96 35.24,22.16 34.76,22.64 v33.88,22.64 | v37.34,21.77 37.34,20.82 38.29,19.87 U1.18 | U2.22 27.07,16.95 28.07,16.95 v28.19,16.82 | v29.34,16.25 29.34,17.01 v30.29,17.96 | v30.1,30.92 33.01,30.92 v33.02,30.93
  Bottom 0.254: v37.34,21.77 v35.81,21.77 | v28.19,16.82 28.19,16.76 28.7,16.25 v29.34,16.25 | v30.29,17.96 33.88,21.55 v33.88,22.64 33.02,23.49 v33.02,30.93 | v30.1,30.92 v27.05,30.92
N$1
  Top 0.254: R1.2 45.34,31.68 45.34,27.93 49.21,24.06 50.29,24.06 U1.9
N$4  (via drill 0.3, 0.35)
  Top 0.254: U2.7 23,10.88 23,10.13 22.6,9.72 v22.6,9.55 | v19.63,9.45 19.66,9.41 19.66,8.35 17.72,6.4 17.72,3.42 17.3,3.01 v17.3,1.95 | U$2.15 10.58,2.47 v12.1,0.95
  Bottom 0.254: v19.63,9.45 22.5,9.45 v22.6,9.55 | v12.1,0.95 16.3,0.95 v17.3,1.95
N$5  (via drill 0.3)
  Top 0.254: IC1.4 30.81,19.96 31.14,19.96 v31.43,20.25 | v29.91,18.54 28.77,17.39 28.77,15.3 30.1,13.96 R3.1
  Bottom 0.254: v31.43,20.25 29.91,18.73 v29.91,18.54
N$6
  Top 0.254: U2.10 24.61,9.44 25.03,9.02 26.23,9.02 27.9,7.34 27.9,1.4 27.7,1.2 LED1.C
N$7
  Top 0.254: C9.1 R1.1 43.6,32.42 44.32,33.14 46.74,33.14 48.2,31.68 L1.1
N$8
  Top 0.254: LED2.C 30.99,1.2 30.73,1.45 30.73,5.32 26.54,9.51 25.37,9.51 25.11,9.77 U2.11
N$10
  Top 0.254: IC1.9 32.26,18.66 32.26,16.69 32,16.44 C14.1
N$11
  Top 0.254: 40.96,9.58 D1.1 41.15,9.39 41.15,9.45 41.15,9.55 41.27,9.68 | 38.1,9.58 CELL.+
  Top 0.61: U1.22 41.2,15.45 43.24,13.41 43.24,11.64 41.27,9.68 | D2.1 41.11,9.43 40.96,9.58 | CELL.+ 41.03,9.57 41.15,9.45
N$12
  Top 0.254: LED2.A 33.15,1.2 33.15,4.12 R10.2
N$13  (via drill 0.35)
  Top 0.254: C11.2 31.43,27.87 31.43,25.01 31.62,24.82 FC-135.P$2 31.05,24.7 v30.8,24.45
  Top 0.406: v31.7,22.85 31.77,22.78 IC1.27
  Bottom 0.254: v31.7,22.85 31.7,23.55 v30.8,24.45
N$14
  Top 0.254: IC1.26 32.29,21.84 32.29,22.64 34.29,24.63 FC-135.P$1 34.29,24.82 33.53,25.58 33.53,27.87 C10.2
N$70  (via drill 0.35)
  Top 0.254: C8.2 24.96,1.96 24.96,4.44 24.77,4.63 24.74,4.65 | 24.74,4.65 CRYSTAL.1 | U2.4 21.61,7.24 v21.9,6.95 | v23.9,6.85 24.74,6.01 24.74,4.65
  Bottom 0.254: v21.9,6.95 22,6.85 v23.9,6.85
N$71
  Top 0.254: C7.2 20,1.96 20,4.44 20.19,4.63 CRYSTAL.2 20.38,4.82 21.05,5.48 21.05,10.93 U2.3
N$74
  Top 0.254: LED1.A 28.77,1.2 28.77,4.12 R8.2
SWCLK1
  Top 0.254: U2.37 17.79,17.92 17.78,17.93 15.88,17.93 10.58,12.63 U$2.11
SWDIO1  (via drill 0.3)
  Top 0.254: v21.14,18.16 21.14,19.3 U2.34 | v17.48,18.64 17.28,18.43 15.74,18.43 12.61,15.3 5.14,15.3 U$2.10
  Bottom 0.254: v21.14,18.16 17.96,18.16 v17.48,18.64
TEMP  (via drill 0.3)
  Top 0.254: R9.1 20,31.68 20,34.16 R7.1 20,34.35 20,37.97 TEMP.1 | v29.44,11.93 29.44,13.86 27.81,15.49 27.05,15.49 U2.19
  Bottom 0.254: v29.44,11.93 29.54,11.93 29.94,11.53 31.11,11.53 31.62,11.02 31.62,6.6 31.24,6.22 15.52,6.22 15.24,6.49 15.24,13.32 16.91,15 16.91,21.58 20.05,24.71 TEMP.1
TEMP_HIGH
  Top 0.254: R7.2 17.54,34.22 17.27,33.95 17.27,24.89 21.65,20.5 21.65,19.39 U2.33
TEMP_LOW
  Top 0.254: R9.2 17.78,31.26 17.78,24.94 22.1,20.63 22.1,19.49 U2.32
UART_RTX  (via drill 0.3)
  Top 0.254: v28.38,12.57 28.26,12.44 27.05,12.44 U2.13
  Bottom 0.254: v28.38,12.57 28.89,13.07 32.45,13.07 33.53,14.15 33.53,14.54 31.18,16.88 29.81,16.88 28.9,17.79 28.9,18.8 29.66,19.57 29.66,25.67 31.55,27.56 31.55,35.8 35.05,39.3 UART.4
UART_TRX  (via drill 0.3)
  Top 0.254: v36.01,6.43 35.95,6.38 33.46,6.38 29.72,10.12 25.72,10.12 25.61,10.23 U2.12
  Bottom 0.254: v36.01,6.43 36.1,6.53 37.26,6.53 41.39,10.66 41.39,33.35 36.96,37.78 36.96,39.11 36.77,39.3 UART.3
USB_D+
  Top 0.254: J1.D+ 44.45,5.01 45.33,5.89 50.74,5.89 52.14,7.29 52.14,18.14 51.55,18.73 50.48,18.73 U1.6
USB_D-
  Top 0.254: U1.5 50.48,17.58 51.44,17.58 51.65,17.38 51.65,7.4 50.58,6.33 45.11,6.33 43.8,5.02 J1.D-
VBAT  (via drill 0.3)
  Top 0.254: 42.69,6.91 D2.2 | U2.1 20.11,10.05 20.57,9.58 20.57,8.08 20.11,7.62
  Top 0.406: 20.11,7.62 18.95,6.46 v18.95,5.09
  Top 0.61: v18.82,2.22 18.94,2.34 v18.94,5.09 v18.95,5.09 | 42.69,6.91 42.49,6.91 41.35,5.78 33.83,5.78 v33.8,5.8 | v11.39,16.76 11.39,16.88 11.39,18.2
  Top 0.813: U$2.4 5.06,30.35 10.68,30.35 13.81,27.22 13.81,20.62 11.39,18.2
  Bottom 0.61: v11.39,16.76 11.39,14.44 12.4,13.43 12.4,4.96 12.47,4.9 12.47,4.74 14.1,3.11 17.93,3.11 v18.82,2.22 | v18.95,5.09 33.1,5.09 v33.8,5.8
VCC  (via drill 0.3)
  Top 0.254: 14.67,3.49 MCP2562.3 14.48,3.68 14.48,4.06 14.42,4.12
  Top 0.61: C1.1 14.59,3.41 14.67,3.49 | v14.12,14.84 14.21,14.75 14.21,13.89
  Top 0.813: C1.1 15.67,1.84 v15.7,1.86 | U$2.2 11.12,35.49 v11.15,35.46 | v11.13,11.22 11.53,11.22 14.21,13.89
  Bottom 0.813: v11.15,35.46 13.91,32.7 13.91,14.97 13.99,14.97 v14.12,14.84 | v11.13,11.22 11.03,11.12 11.03,3.05 12.09,1.99 15.58,1.99 v15.7,1.86
VDD  (via drill 0.3, 0.35)
  Top 0.254: 27.3,4.12 R8.1 | v18.11,8.72 18.29,8.9 18.29,9.58 C5.1 | 15.81,10.34 C2.1 | 15.81,9.01 MCP2562.5 | 25.02,8.46 C3.1 24.11,8.83 U2.9 | 18.86,12.44 U2.48 18.71,12.45 19.16,12.45 19.28,12.33 | 28.96,24.63 C13.1 28.79,24.03 | 30.67,20.44 IC1.3 | 27.05,17.96 U2.24 26.86,17.96 26.29,17.96 | 28.77,21.77 28.77,22.16 C12.1 28.96,22.16 28.96,22.45 v28.73,22.67 | 28.38,19.49 C4.1 | 35.62,13.77 C17.1 35.81,13.96 | 39.05,14.34 38.48,14.34 U1.23 | 42.67,9.58 D1.2 42.67,9.39 | 50.29,19.68 U1.7 50.48,19.87 | 23.81,27.87 R4.2 | 24.96,31.68 C16.1 | 28.96,30.54 IC3.2 | 29.72,32.63 29.6,32.68 | 29.6,32.68 IC3.8 29.72,32.82 | 32,31.68 C15.1 32.1,31.75 | 30.67,38.55 30.67,38.35 | 19.05,20.63 C6.1 18.86,20.82 | IC1.28 31.27,22.28 30.98,22.57 v30.98,22.65 | 29.72,32.57 29.6,32.68 | 29.4,35.27 29.6,35.27 | 29.6,37.28 29.6,37.05 | 27.97,31.88 28.25,32.16 IC3.6 28.2,32.66 28.2,32.09
  Top 0.406: C16.1 25.18,31.88 27.97,31.88 | 28.2,32.12 28.2,32.09 28.95,31.34 28.95,30.54 28.96,30.54 28.96,30.38 27.51,28.93 27.51,27.88 R5.2 | v28.73,23.98 28.79,24.03 | C13.1 29.55,25.45 v30.4,25.45 | v28.73,22.67 28.77,22.64 28.77,21.77 | C12.1 28.75,22.19 28.75,22.23 30.23,23.7 v30.23,24.05 | IC1.3 30.23,20.5 v30.23,20.56 | v28.3,21.25 27.82,21.25 27.53,20.96 27.53,20.14 28.18,19.49 C4.1 28.43,19.35 27.05,17.96 | 19.28,12.33 19.29,12.33 19.29,10.59 C5.1 | U2.36 20.11,20.44 19.89,20.66 19.4,20.66 19.02,20.66
  Top 0.508: 25.1,31.54 24.96,31.68
  Top 0.61: R6.2 35.81,16.4 35.81,13.96 36.51,13.96 36.9,14.35 U1.23 40.77,14.35 42.5,12.62 v42.5,12.05 | v47.1,19.05 47.9,19.85 U1.7 | v40,6.95 39.9,7.05 36.7,7.05 35.77,7.97 C17.1 34.44,12.57 33.05,12.57 31.96,13.65 R3.2 | v15.86,11 15.86,10.76 C2.1 15.88,10.28 MCP2562.5 | v18.11,8.72 18.57,9.18 18.57,9.88 | 27.3,4.12 27.3,7.03 26.15,8.19 C3.1 | v25.66,8.46 25.02,8.46 | v28.05,8.82 28.11,8.76 28.11,8.74 31.54,5.31 R10.1 | C15.1 30.6,31.68 29.72,32.57 | C6.1 19.32,20.74 19.4,20.66
  Top 0.813: U$2.3 15.1,32.95 15.2,33.05 | 15.2,33.05 15.7,33.55 15.7,38.65 16.83,39.78 21.47,39.78 23.6,37.65 23.6,35.27 | 23.2,29.65 22,29.65 22,32.79 23.6,34.39 23.6,35.27 | 23.2,29.65 23.71,29.14 R4.2 | 23.2,29.65 24.6,29.65 25,30.05 25,31.66 C16.1 | 23.6,35.27 29.4,35.27 | 32.1,31.75 32.1,32.9 29.72,35.27 29.6,35.27 29.6,37.05 29.6,37.48 30.67,38.55 | I2C.1 30.67,39.14 30.67,38.55 | 30.67,38.55 31.37,37.85 38.9,37.85 39.72,38.66 UART.1 39.97,39.05 48.56,39.05 49.78,37.82 49.78,36.12 52.85,33.06 52.85,21.92 52.28,21.35 45.6,21.35 44.3,20.05 v44.3,11.45 42.71,9.86 D1.2 | 15.2,33.05 15.72,32.53 15.72,23.95 C6.1
  Bottom 0.254: 24.02,8.82 24.02,8.95 | 28.96,26.92 30.67,28.63 30.67,39.14 I2C.1 30.67,39.3
  Bottom 0.406: v30.4,25.45 31,25.45 32.5,23.95 32.5,21.85 31.65,21.85 30.98,22.52 v30.98,22.65 | v30.23,24.05 v30.23,20.56
  Bottom 0.61: v47.1,19.05 47.1,16.65 v42.5,12.05 | v44.3,11.45 44.3,11.15 40.05,6.9 v40,6.95 | 28.96,26.92 28.76,26.72 28.76,24 | 28.76,23.35 28.76,21.45 | 28.76,21.45 28.76,19.96 23.3,14.5 23.3,12.33 24.02,11.61 24.02,8.95 | v28.05,8.82 25.66,8.82 | 25.66,8.82 24.02,8.82 23.73,8.82 23.63,8.72 v18.11,8.72 16.51,8.72 15.86,9.37 v15.86,11 | v25.66,8.46 25.66,8.82 | v28.3,21.25 28.5,21.45 28.76,21.45 | v28.73,23.98 28.76,24 | 28.76,24 28.76,23.35 | v28.73,22.67 28.73,23.33 28.76,23.35

### Text on the board
tNames: ERR | STAT | GNSS
tStop: WASA Rocket 2023
bStop: INS Module | Designed by @fujiy0, 2019